# EAGLE schematic TFDU4101 Connection Schematic (EAGLE 9.6.2)
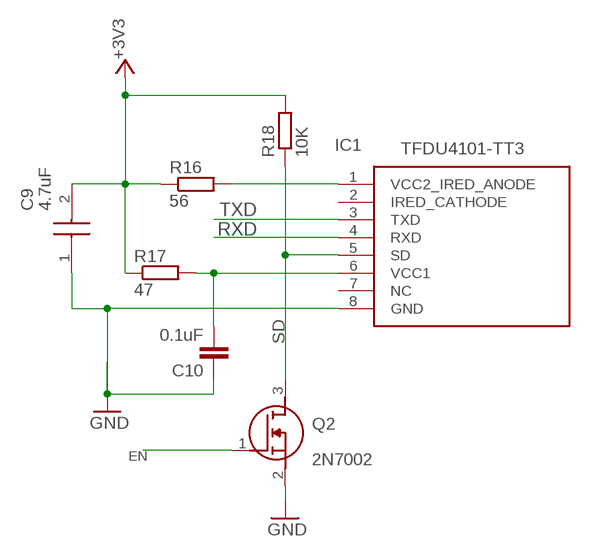
[diagram p0: schematic, sheet 1]

## Parts
C9  4.7uF  CL21A475KPFNNNG  [CAPC2012X135N]
C10  0.1uF  C-EUC0805  [C0805]
IC1  TFDU4101-TT3  [TFDU4101-TR3]
Q2  2N7002  [SOT96P240X120-3N]
R16  56  R-EU_R0805  [R0805]
R17  47  R-EU_R0805  [R0805]
R18  10K  R-EU_R0805  [R0805]

## Nets
+3V3: C9.2 R16.1 R17.1 R18.2
EN: Q2.1(G)
GND: C9.1 C10.1 IC1.8(GND) Q2.2(S)
N$1: IC1.1(VCC2_IRED_ANODE) R16.2
N$5: C10.2 IC1.6(VCC1) R17.2
RXD: IC1.4(RXD)
SD: IC1.5(SD) Q2.3(D) R18.1
TXD: IC1.3(TXD)
Unconnected: IC1.2(IRED_CATHODE) IC1.7(NC)

## Library data of the parts
C9 = SamacSys_Parts:CL21A475KPFNNNG: Samsung Electro-Mechanics 0805 (2012M) 4.7uF Multilayer Ceramic Capacitor MLCC 10V dc +/-10% SMD CL21A475KPFNNNG Source: Datasheet <https://www.arrow.com/en/products/cl21a475kpfnnng/samsung-electro-mechanics>; DESCRIPTION: Samsung Electro-Mechanics 0805 (2012M) 4.7uF Multilayer Ceramic Capacitor MLCC 10V dc +/-10% SMD CL21A475KPFNNNG; HEIGHT: 1.35mm; MANUFACTURER_NAME: Samsung Electro-Mechanics; MANUFACTURER_PART_NUMBER: CL21A475KPFNNNG; MOUSER_PART_NUMBER: N/A; MOUSER_PRICE-STOCK: https://www.mouser.co.uk/ProductDetail/Samsung-Electro-Mechanics/CL21A475KPFNNNG?qs=hqM3L16%252BxlcGfG%252Bpyn05ZQ%3D%3D
C10 = rcl:C-EU: CAPACITOR, European symbol; SPICEPREFIX: C
IC1 = SamacSys_Parts:TFDU4101-TT3: TFDU4101-TT3 Vishay, IR Transceiver, 900nm 115.2kbit/s, 1m Range, SMT, 9.7 x 4.7 x 4mm Source: Datasheet <https://www.vishay.com/docs/81288/tfdu4101.pdf>; DESCRIPTION: TFDU4101-TT3 Vishay, IR Transceiver, 900nm 115.2kbit/s, 1m Range, SMT, 9.7 x 4.7 x 4mm; HEIGHT: mm; MANUFACTURER_NAME: Vishay; MANUFACTURER_PART_NUMBER: TFDU4101-TT3; MOUSER_PART_NUMBER: 782-TFDU4101-TT3; MOUSER_PRICE-STOCK: https://www.mouser.co.uk/ProductDetail/Vishay-Semiconductors/TFDU4101-TT3?qs=quKhnJqH4FjS%252BNmEWt20aw%3D%3D
Q2 = SamacSys_Parts:2N7002: N-channel MOSFET,2N7002 0.115A 60V Source: Datasheet <https://www.onsemi.com/pub/Collateral/NDS7002A-D.PDF>; DESCRIPTION: N-channel MOSFET,2N7002 0.115A 60V; HEIGHT: 1.2mm; MANUFACTURER_NAME: ON Semiconductor; MANUFACTURER_PART_NUMBER: 2N7002; MOUSER_PART_NUMBER: 512-2N7002; MOUSER_PRICE-STOCK: https://www.mouser.co.uk/ProductDetail/ON-Semiconductor-Fairchild/2N7002?qs=0dwsXDNhqlz66WJJhrTFjQ%3D%3D
R16-R18 = rcl:R-EU_: RESISTOR, European symbol; SPICEPREFIX: R